# EAGLE design Adafruit_NeoPixel_Driver_BFF (EAGLE 9.6.2)
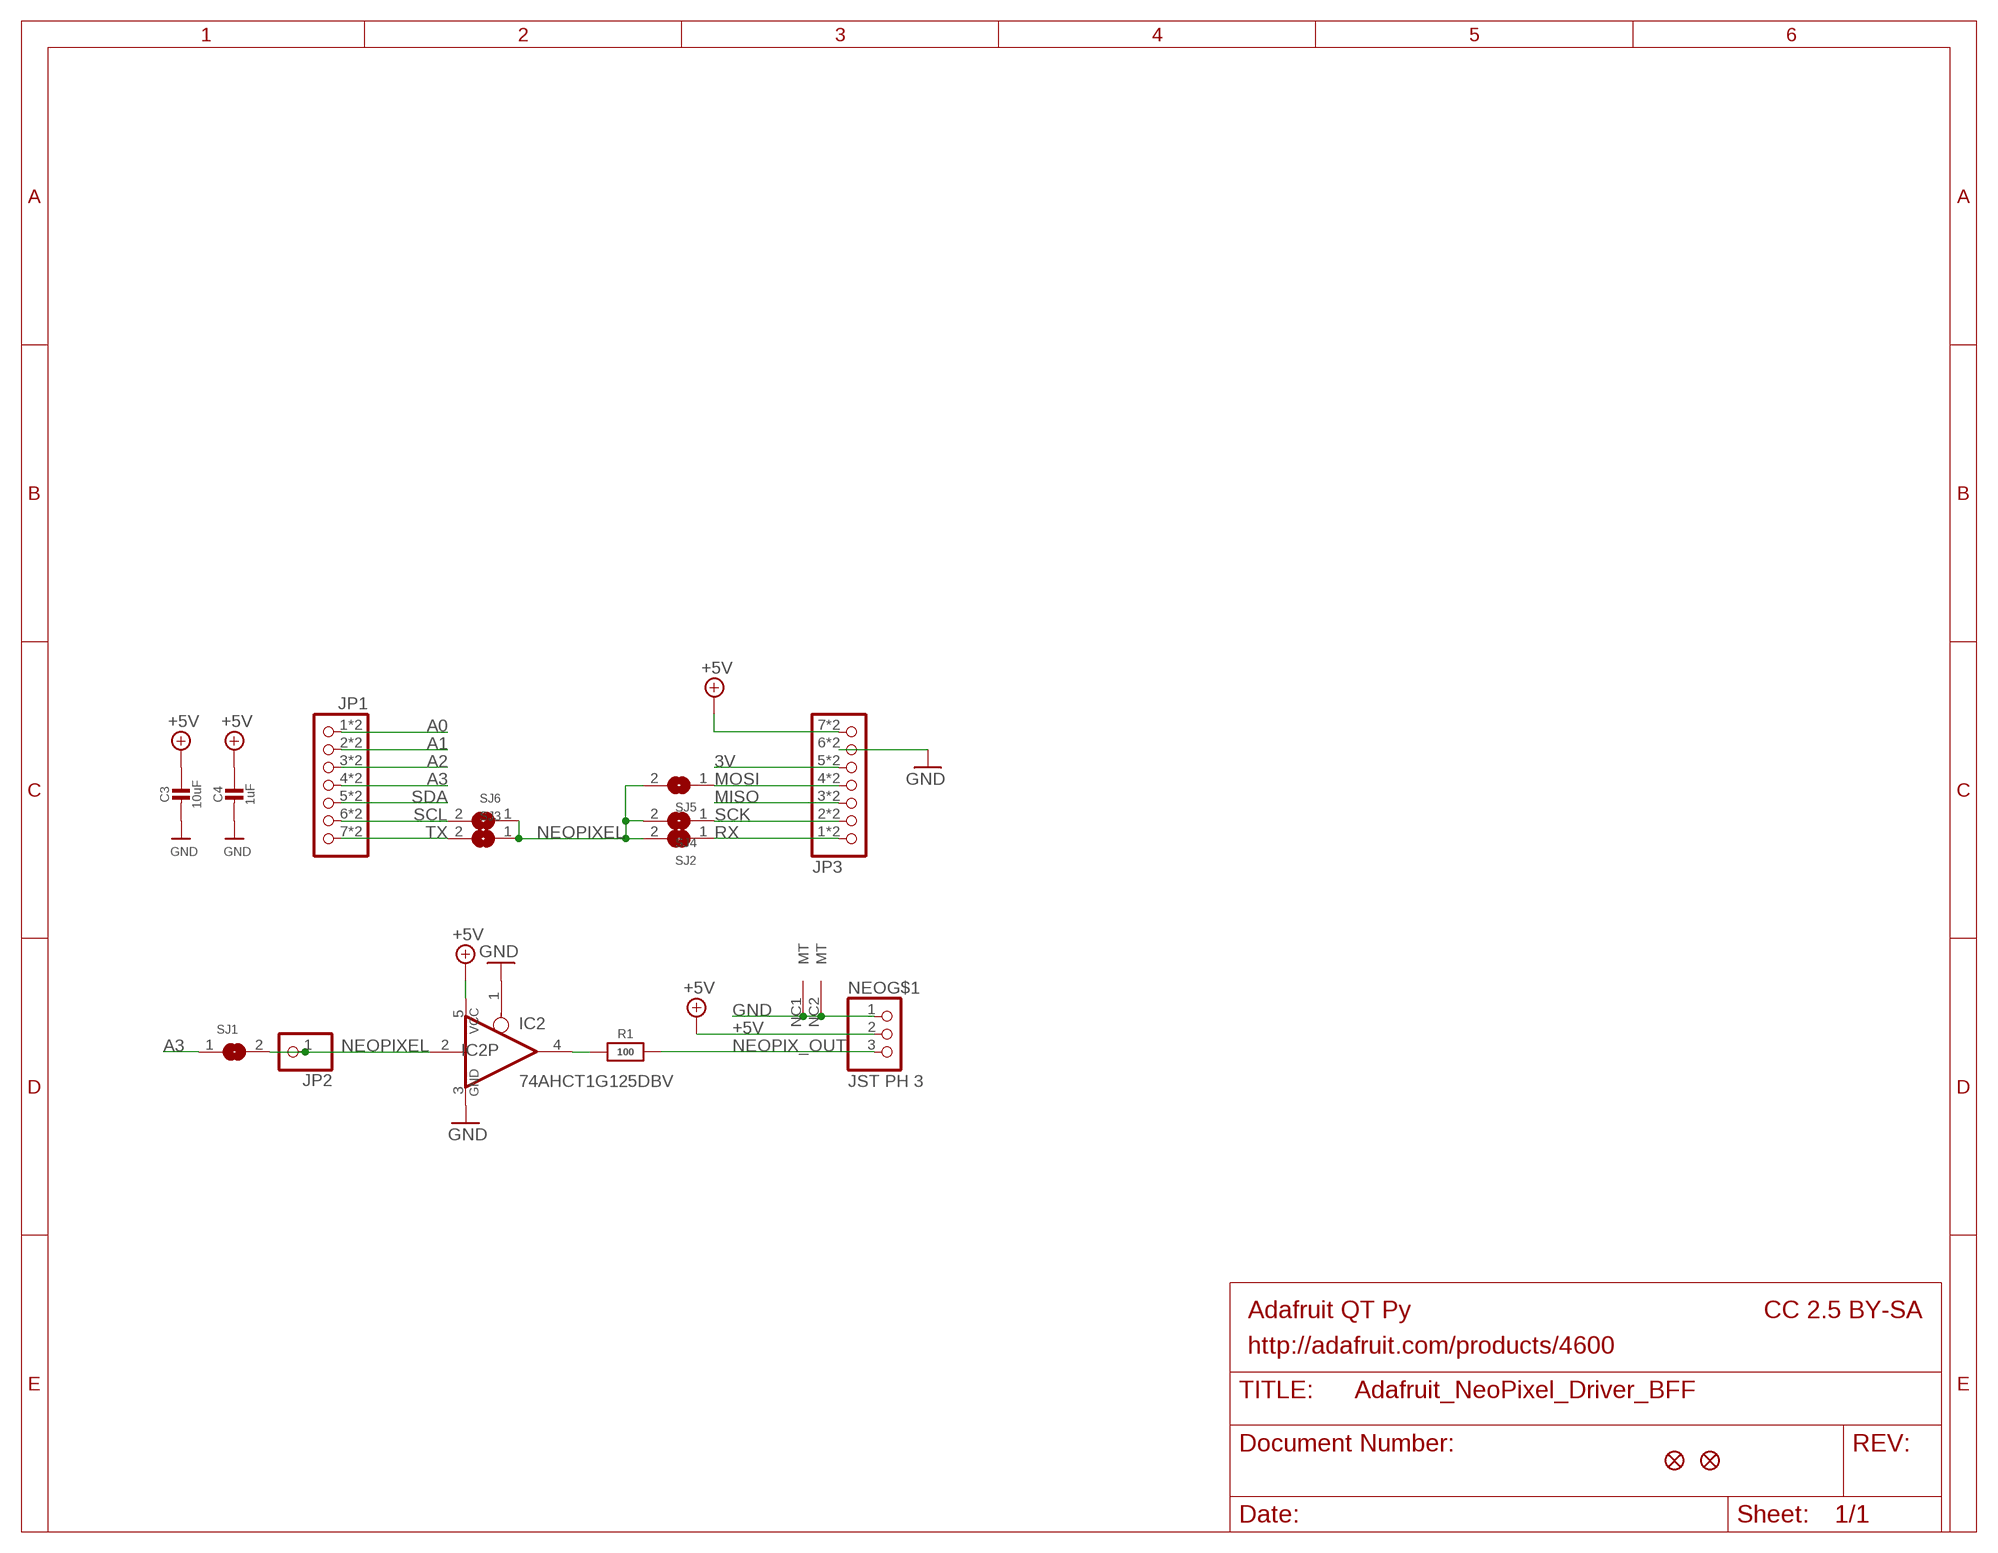
[diagram p0: schematic, sheet 1]

## Parts
C3  10uF  CAP_CERAMIC0805-NOOUTLINE  [0805-NO]
C4  1uF  CAP_CERAMIC0603_NO  [0603-NO]
IC2  74AHCT1G125DBV  [SOT23-5]
JP1  HEADER-1X7_CASTEL  [1X07_CASTEL]
JP2  HEADER-1X1ROUND_76MIL  [1X01_ROUND_76MIL]
JP3  HEADER-1X7_CASTEL  [1X07_CASTEL]
NEO  JST PH 3  CON_JST_PH_3PIN  [JSTPH3]
R1  100  RESISTOR_0603_NOOUT  [0603-NO]
SJ1  SOLDERJUMPERCLOSED  [SOLDERJUMPER_CLOSEDWIRE]
SJ2  SOLDERJUMPER  [SOLDERJUMPER_ARROW_NOPASTE]
SJ3  SOLDERJUMPER  [SOLDERJUMPER_ARROW_NOPASTE]
SJ4  SOLDERJUMPER  [SOLDERJUMPER_ARROW_NOPASTE]
SJ5  SOLDERJUMPER  [SOLDERJUMPER_ARROW_NOPASTE]
SJ6  SOLDERJUMPER  [SOLDERJUMPER_ARROW_NOPASTE]
U$6  FIDUCIAL_1MM  [FIDUCIAL_1MM]
U$8  FIDUCIAL_1MM  [FIDUCIAL_1MM]

## Nets
3V: JP3.5 JP3.5C
+5V [power]: C3.1 C4.1 IC2.5(VCC) JP3.7 JP3.7C NEO.2
A0: JP1.1 JP1.1C
A1: JP1.2 JP1.2C
A2: JP1.3 JP1.3C
A3: JP1.4 JP1.4C SJ1.1
GND [power]: C3.2 C4.2 IC2.1(OE) IC2.3(GND) JP3.6 JP3.6C NEO.1 NEO.NC1(MT) NEO.NC2(MT)
MISO: JP3.3 JP3.3C
MOSI: JP3.4 JP3.4C SJ5.1
N$1: IC2.4(O) R1.1
NEOPIX_OUT: NEO.3 R1.2
NEOPIXEL: IC2.2(I) JP2.1 SJ1.2 SJ2.2 SJ3.1 SJ4.2 SJ5.2 SJ6.1
RX: JP3.1 JP3.1C SJ2.1
SCK: JP3.2 JP3.2C SJ4.1
SCL: JP1.6 JP1.6C SJ6.2
SDA: JP1.5 JP1.5C
TX: JP1.7 JP1.7C SJ3.2

## Notes on the sheet
- Adafruit QT Py | CC 2.5 BY-SA
- http://adafruit.com/products/4600

## Library data of the parts
C3 C4 = microbuilder:CAP_CERAMIC: Ceramic Capacitors For new designs, use the packages preceded by an '_' character since they are more reliable: The following footprints should be used on most boards: _0402 - Standard footprint for regular board layouts _0603 - Standard footprint for regular board layouts _0805 - Standard footprint for regular board layouts _1206 - Standard footprint for regular board layouts For extremely tight-pitch boards where space is at a premium, the following 'micro-pitch' footprints can be used (smaller pads, no silkscreen outline, etc.): _0402MP - Micro-pitch footprint for very dense/compact boards _0603MP - Micro-pitch footprint for very dense/compact boards _0805MP - Micro-pitch footprint for very dense/compact boards _1206MP - Micro-pitch footprint for very dense/compact boards
IC2 = 74xx-little-us:74*1G125: Single Bus Buffer Gate with 3-State Output
JP1 JP3 = adafruit_electromech:HEADER-1X7: PIN HEADER
JP2 = microbuilder:HEADER-1X1: PIN HEADER
NEO = adafruit_electromech:CON_JST_PH_3PIN
R1 = microbuilder:RESISTOR: Resistors For new designs, use the packages preceded by an '_' character since they are more reliable: The following footprints should be used on most boards: _0402 - Standard footprint for regular board layouts _0603 - Standard footprint for regular board layouts _0805 - Standard footprint for regular board layouts _1206 - Standard footprint for regular board layouts For extremely tight-pitch boards where space is at a premium, the following 'micro-pitch' footprints can be used (smaller pads, no silkscreen outline, etc.): _0402MP - Micro-pitch footprint for very dense/compact boards _0603MP - Micro-pitch footprint for very dense/compact boards _0805MP - Micro-pitch footprint for very dense/compact boards _1206MP - Micro-pitch footprint for very dense/compact boards
SJ1 = microbuilder:SOLDERJUMPER: SMD Solder JUMPER Solder the two pads together to create a connection, or remove the solder to break it. REFLOW - Use this footprint for solder paste and reflow ovens. WAVE - Use this footprint for hand-soldering (larger pads). CLOSED - Has a trace between the two pads to ensure it is closed by default. The trace needs to be cut to disable the jumper, and can be closed again by creating a solder bridge between the two pads.
SJ2-SJ6 = microbuilder:SOLDERJUMPER: SMD Solder JUMPER Solder the two pads together to create a connection, or remove the solder to break it. REFLOW - Use this footprint for solder paste and reflow ovens. WAVE - Use this footprint for hand-soldering (larger pads). CLOSED - Has a trace between the two pads to ensure it is closed by default. The trace needs to be cut to disable the jumper, and can be closed again by creating a solder bridge between the two pads.; BOM: EXCLUDE
U$6 U$8 = microbuilder:FIDUCIAL: Fiducial Alignment Points Various fiducial points for machine vision alignment.; BOM: EXCLUDE

## Net classes
1 power: width 0.305 mm
2 thickpower: width 0.406 mm

## Board
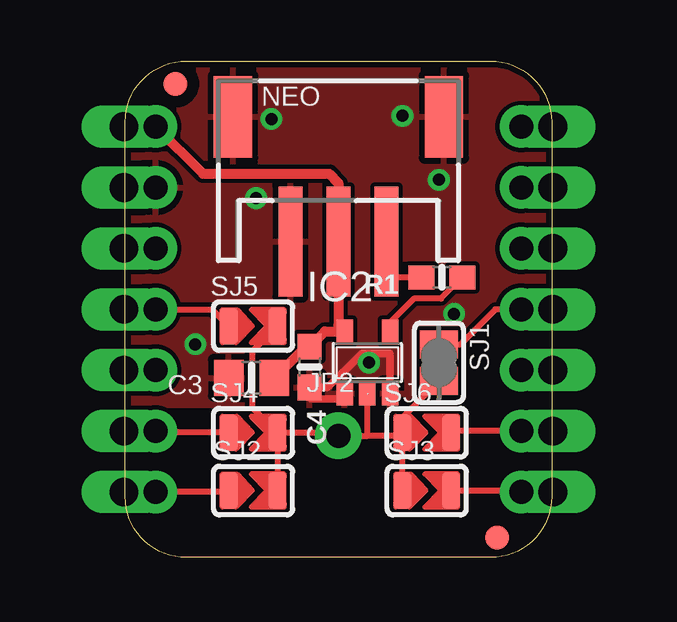
[diagram p1: board, top side]
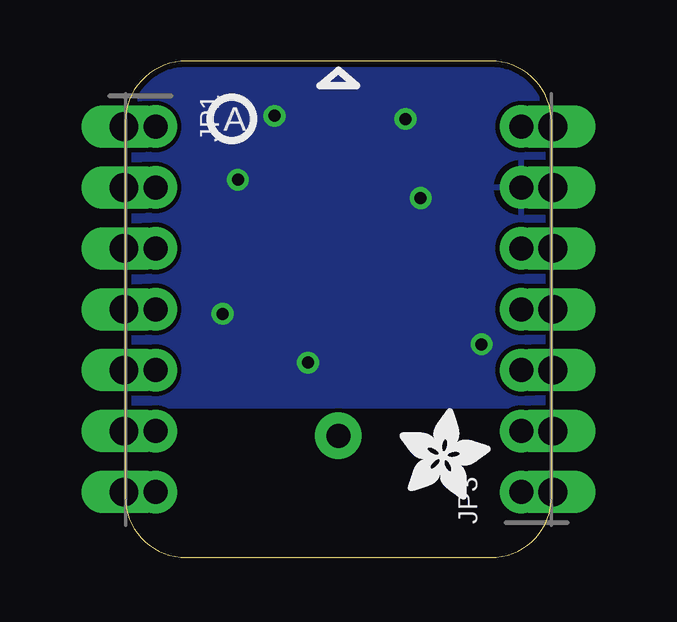
[diagram p2: board, bottom side, seen from below]

Size 17.78 x 20.7 mm. Coordinates in mm from the lower left corner, seen from the top.
Outline: 17.78,18.16 17.78,2.54 arc-90 15.24,0 2.54,0 arc-90 0,2.54 0,18.16 arc-90 2.54,20.7 15.24,20.7 arc-90 17.78,18.16
Copper layers (1*16): Top 0.035mm / dielectric 1.5mm / Bottom 0.035mm
Design rules "adafruit 7-7": minimum track width 7mil, minimum drill 15.5mil, track to track 7mil, track to pad 7mil, pad to pad 7mil, via to via 7mil, smd to smd 7mil, copper to edge 10mil, drill to drill 8mil, minimum pad ring 7mil, minimum via ring 8mil, stop-mask expansion 2mil, vias tented up to drill 20mil, thermal gap 10mil

### Footprints (pad centres in the part's own frame; a part is rotated, then mirrored left to right if it is on the bottom)
0805-NO = smd 1.24 x 1.5: 1 -0.95,0; 2 0.95,0
0603-NO = smd 1.075 x 1: 1 -0.85,0; 2 0.85,0
SOT23-5 = smd 0.69 x 0.99: 1 -0.95,-1.29; 2 0,-1.29; 3 0.95,-1.29; 4 0.95,1.3; 5 -0.95,1.3
1X07_CASTEL = drill 1 pad 1.778: 1 -7.62,0; 2 -5.08,0; 3 -2.54,0; 4 0,0; 5 2.54,0; 6 5.08,0; 7 7.62,0 | drill 1.2 pad 1.778 long: 1C -7.62,-1.324; 2C -5.08,-1.324; 3C -2.54,-1.324; 4C 0,-1.324; 5C 2.54,-1.324; 6C 5.08,-1.324; 7C 7.62,-1.324
1X01_ROUND_76MIL = drill 1 pad 1.93: 1 0,0
JSTPH3 = smd 1 x 4.6: 1 -2,-2.7; 2 0,-2.7; 3 2,-2.7 | smd 1.6 x 3.4: NC1 -4.4,2.5; NC2 4.4,2.5
SOLDERJUMPER_CLOSEDWIRE = smd 1.168 x 1.6: 1 -0.762,0; 2 0.762,0 | smd 0.635 x 0.203: WIRE 0,0
SOLDERJUMPER_ARROW_NOPASTE = smd 0.762 x 1.524: 1 -1.016,0; 2 1.016,0
FIDUCIAL_1MM = smd 1 x 1: 1 0,0

### Placement (x,y rotation side)
C3  5.27,7.49 180 top
C4  7.68,7.94 270 top
IC2  10.1,8.13 0 top
JP1  16.51,10.35 270 bottom
JP2  8.89,5.08 0 top
JP3  1.27,10.35 90 bottom
NEO  8.89,15.88 0 top
PLABEL0  [PLABEL0]  8.76,0.89 0 top
PLABEL1  [PLABEL1]  14.99,2.54 90 top
PLABEL2  [PLABEL2]  14.99,5.21 90 top
PLABEL3  [PLABEL3]  2.92,17.84 90 top
PLABEL4  [PLABEL4]  14.86,15.62 90 top
PLABEL5  [PLABEL5]  14.86,13.08 90 top
PLABEL6  [PLABEL6]  14.86,18.16 90 top
PLABEL7  [PLABEL7]  14.61,10.54 0 top
PLABEL8  [PLABEL8]  2.92,15.43 90 top
PLABEL9  [PLABEL9]  2.92,12.89 90 top
PLABEL10  [PLABEL10]  2.92,10.35 90 top
PLABEL11  [PLABEL11]  2.92,7.81 90 top
PLABEL12  [PLABEL12]  14.99,8.13 90 top
PLABEL13  [PLABEL13]  2.92,5.27 90 top
PLABEL14  [PLABEL14]  2.92,2.73 90 top
PLABEL15  [PLABEL15]  5.08,12.45 0 top
PLABEL16  [PLABEL16]  11.68,12.57 0 top
PLABEL17  [PLABEL17]  9.02,9.65 0 top
PLABEL18  [PLABEL18]  7.62,2.54 0 top
PLABEL19  [PLABEL19]  8.76,18.41 0 bottom
PLABEL20  [PLABEL20]  8.89,12.19 0 bottom
R1  13.21,11.68 180 top
SJ1  13.08,8.13 270 top
SJ2  5.33,2.79 0 top
SJ3  12.57,2.79 0 top
SJ4  5.33,5.21 0 top
SJ5  5.33,9.65 0 top
SJ6  12.57,5.21 0 top
U$2  [ADAFRUIT_3.5MM]  6.35,2.41 0 bottom
U$3  [PCBFEAT-REV-040]  13.34,18.29 0 bottom
U$6  15.51,0.83 0 top
U$8  2.1,19.75 0 top

### Tracks (layer width: path | path; a pad name or v marks a point on that pad's centre or on a via)
3V
  Top 0.254: JP3.5C JP3.5
+5V
  Top 0.305: JP3.7C JP3.7
  Top 0.406: JP3.7 3.24,16 8.51,16 8.89,15.62 NEO.2 8.89,9.68 IC2.5 8.32,9.43 C4.1 7.51,8.79 C3.1
A0
  Top 0.254: JP1.1C JP1.1
A1
  Top 0.254: JP1.2C JP1.2
A2
  Top 0.254: JP1.3C JP1.3
A3
  Top 0.254: JP1.4 JP1.4C 15.43,10.35 13.97,8.89 SJ1.1
GND  (via drill 0.5)
  Top 0.305: IC2.1 8.91,6.6 7.75,6.6 7.75,7.02 C4.2 8.45,7.09 9.87,8.51 11.05,8.51 IC2.3
  other vias: 11.56,18.41 6.1,18.29 5.46,14.99 13.08,15.75 10.16,8.13 13.72,10.16 2.92,8.89
  pour Top: 0,20.7 17.78,20.7 17.78,6.35 0,6.35
  pour Bottom: 0,20.7 17.78,20.7 17.78,6.35 0,6.35
MISO
  Top 0.254: JP3.3C JP3.3
MOSI
  Top 0.254: JP3.4C JP3.4 3.62,10.35 SJ5.1
N$1
  Top 0.254: R1.1 13.17,10.79 12.03,10.79 11.05,9.81 IC2.4
NEOPIX_OUT
  Top 0.254: R1.2 11.11,11.68 10.76,12.03 10.76,13.05 NEO.3
NEOPIXEL
  Top 0.254: JP2.1 9.08,5.1 9.08,5.08 9.27,5.08 | 10.1,5.08 IC2.2 | SJ5.2 5.3,8.6 5.3,6.26 SJ4.2 | SJ3.1 SJ6.1 | SJ6.1 11.49,5.27 11.49,5.78 SJ1.2 | 9.27,5.08 10.1,5.08 | SJ6.1 11.43,5.08 10.1,5.08 | SJ4.2 SJ2.2 | SJ4.2 9.14,5.21 9.27,5.08
RX
  Top 0.254: JP3.1C JP3.1 4.25,2.73 SJ2.1
SCK
  Top 0.254: JP3.2C JP3.2 1.33,5.21 SJ4.1
SCL
  Top 0.254: JP1.6 JP1.6C 13.65,5.27 SJ6.2
SDA
  Top 0.254: JP1.5C JP1.5
TX
  Top 0.254: JP1.7C JP1.7 16.45,2.79 SJ3.2

### Text on the board
Pinguin_tBackup: 5V | A0 | A1 | G | 3V | S | A2 | - | A3 | MO | + | MI | SDA | SCK | SCL | RX | Sig | TX | NeoPixel BFF
Pinguin_bBackup: USB | NeoPixel Driver / Neo+ <-> 5V / QT Py. Solder / back to back / Signal on A3